# Altium schematic sheet CANduino-bootloader.SchDoc
size A4; SheetNumber: 1; SheetTotal: 1
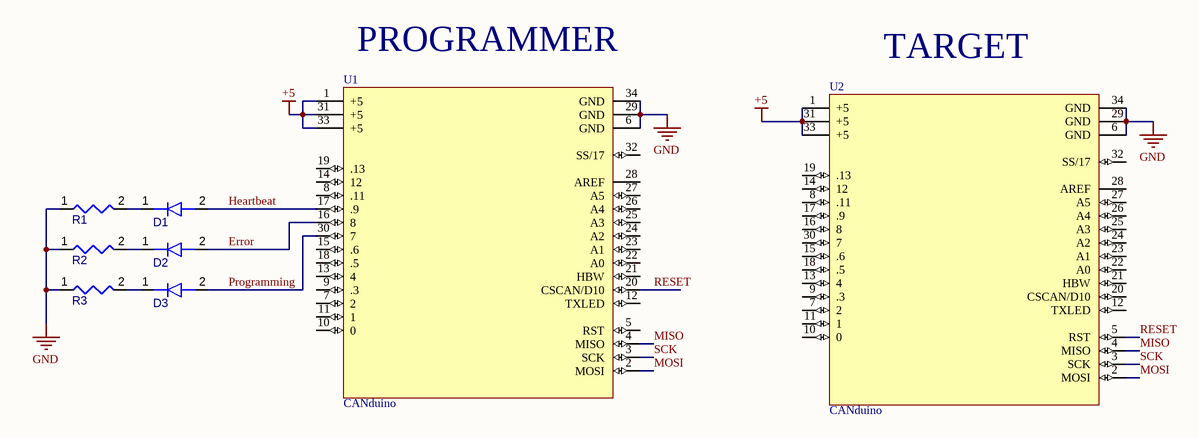
[diagram p0: CANduino-bootloader.SchDoc]

## Parts
D1  Diodes  (value not drawn)
D2  Diodes  (value not drawn)
D3  Diodes  (value not drawn)
R1  Resistors  (value not drawn)
R2  Resistors  (value not drawn)
R3  Resistors  (value not drawn)
U1  CANduino  [299-017-299198-1EDAC]
U2  CANduino  [299-017-299198-1EDAC]

## Nets
+5: U1.1(+5) U1.31(+5) U1.33(+5) U2.1(+5) U2.31(+5) U2.33(+5)
GND: R1.1 R2.1 R3.1 U1.6(GND) U1.29(GND) U1.34(GND) U2.6(GND) U2.29(GND) U2.34(GND)
Error: D2.2(A) U1.16(8)
Heartbeat: D1.2(A) U1.17(.9)
MISO: U1.4(MISO) U2.4(MISO)
MOSI: U1.2(MOSI) U2.2(MOSI)
Programming: D3.2(A) U1.30(7)
RESET: U1.20(CSCAN/D10) U2.5(RST)
SCK: U1.3(SCK) U2.3(SCK)
NetD1_1: D1.1(K) R1.2
NetD2_1: D2.1(K) R2.2
NetD3_1: D3.1(K) R3.2

Not connected (* = marked no-connect by the designer): U1 5(RST) 7(2) 8(.11) 9(.3) 10(0) 11(1) 12(TXLED) 13(4) 14(12) 15(.6) 18(.5) 19(.13) 21(HBW) 22(A0) 23(A1) 24(A2) 25(A3) 26(A4) 27(A5) 28(AREF) 32(SS/17); U2 7(2) 8(.11) 9(.3) 10(0) 11(1) 12(TXLED) 13(4) 14(12) 15(.6) 16(8) 17(.9) 18(.5) 19(.13) 20(CSCAN/D10) 21(HBW) 22(A0) 23(A1) 24(A2) 25(A3) 26(A4) 27(A5) 28(AREF) 30(7) 32(SS/17)

## Notes on the sheet
- (near U1) PROGRAMMER
- (near U2) TARGET

## Library data of the parts
D1-D3 = Diodes: Diode; Component Type: Diodes
R1-R3 = Resistors: Resistor; Component Type: Resistors